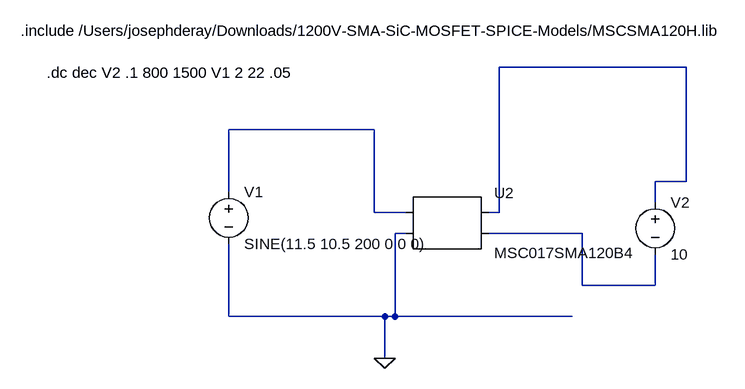
[diagram p0: schematic Drain Curves.asc]
Drain Curves.asc, the LTspice schematic file:
Version 4
SHEET 1 2500 680
WIRE 864 192 576 192
WIRE 384 288 160 288
WIRE 864 368 864 192
WIRE 864 368 816 368
WIRE 160 384 160 288
WIRE 816 400 816 368
WIRE 384 416 384 288
WIRE 432 416 384 416
WIRE 576 416 576 192
WIRE 576 416 560 416
WIRE 432 448 416 448
WIRE 704 448 560 448
WIRE 704 528 704 448
WIRE 816 528 816 480
WIRE 816 528 704 528
WIRE 160 576 160 464
WIRE 400 576 160 576
WIRE 416 576 416 448
WIRE 416 576 400 576
WIRE 688 576 416 576
WIRE 400 640 400 576
FLAG 400 640 0
SYMBOL voltage 160 368 R0
SYMATTR InstName V1
SYMATTR Value SINE(11.5 10.5 200 0 0 0)
SYMBOL voltage 816 384 R0
SYMATTR InstName V2
SYMATTR Value 10
SYMATTR SpiceLine Rser=0
SYMBOL AutoGenerated/MSC017SMA120B4 496 432 R0
SYMATTR InstName U2
TEXT -160 136 Left 2 !.include /Users/josephderay/Downloads/1200V-SMA-SiC-MOSFET-SPICE-Models/MSCSMA120H.lib
TEXT -120 200 Left 2 !.dc dec V2 .1 800 1500 V1 2 22 .05

The netlist it stands for:
* Drain Curves.asc
V1 N002 0 SINE(11.5 10.5 200 0 0 0)
V2 N001 N003 10 Rser=0
* U2: MSC017SMA120B4 (symbol AutoGenerated/MSC017SMA120B4 not available, pins judged from their places): pin1=N002 pin2=0 pin3=N001 pin4=N003
.include /Users/josephderay/Downloads/1200V-SMA-SiC-MOSFET-SPICE-Models/MSCSMA120H.lib
.dc dec V2 .1 800 1500 V1 2 22 .05
.backanno
.end